# EasyEDA Pro project Hitboard_PCB_v1.0.epro

# Board PCB1
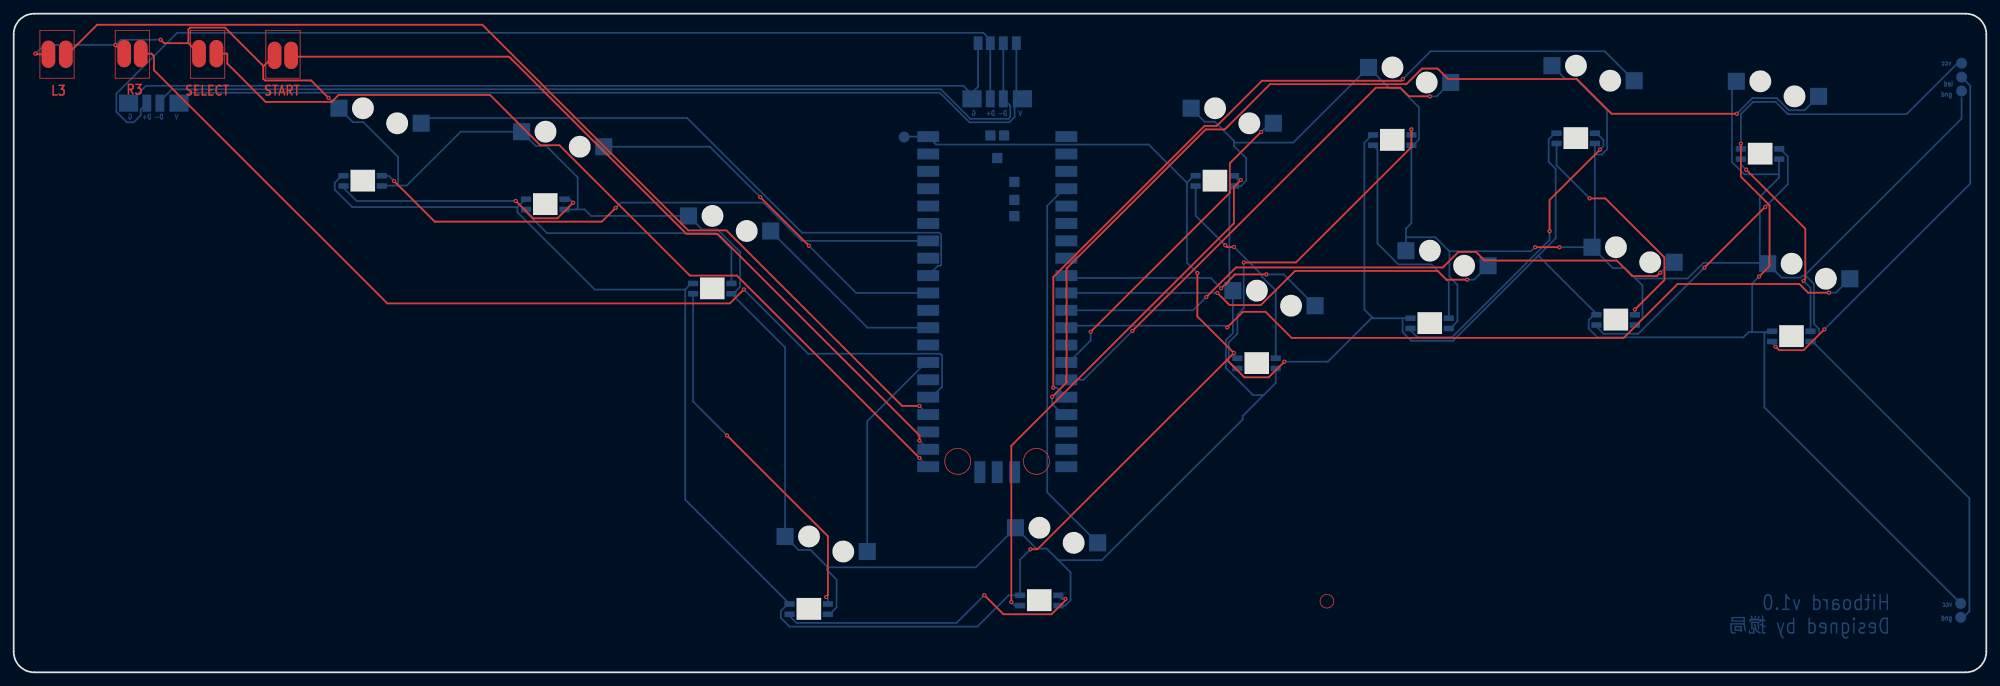
[diagram p0: board, top side]
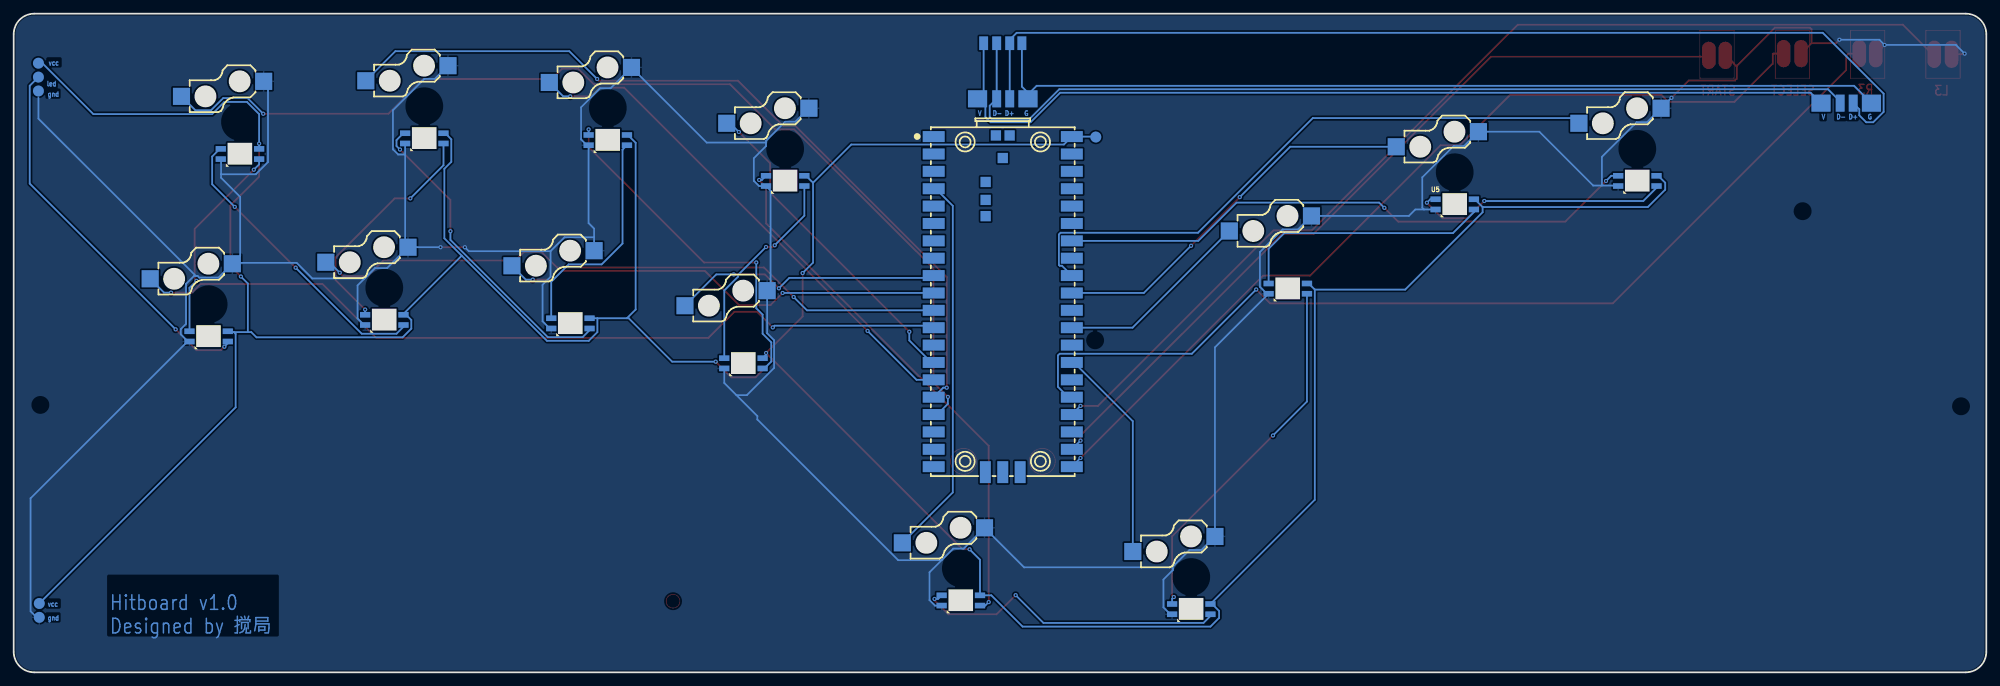
[diagram p1: board, bottom side, seen from below]

Outline 288.1 x 96.3 mm; copper layers: Top Layer, Bottom Layer. Coordinates in mm from the lower left corner of the outline.
Outline path: 0,93.3 0,3 arc(0.88,0.88) 3,0 285.1,0 arc(287.22,0.88) 288.1,3 288.1,93.3 arc(287.22,95.42) 285.1,96.3 3,96.3 arc(0.88,95.42) 0,93.3
Stack: Top Layer 0.035mm / Dielectric1 1.51mm FR4 er 4.5 / Bottom Layer 0.035mm

## Design rules (mm)
template: JLCPCB Capability(Two Layers Board)
spacing copperThickness1oz (default): track to track 0.102, other pairs 0.152 to 0.3
spacing copperThickness2oz: track to track 0.203, other pairs 0.152 to 0.3
track width copperThickness1oz (default): min 0.127, default 0.254, max 2.54
track width copperThickness2oz: min 0.203, default 0.254, max 2.54
differential pair differentialPair (default): width min 0.127, default 0.254, max 2.54; gap min 0.152, default 0.152
via viaSize (default): diameter min 0.5, default 0.61, max 10; hole min 0.3, default 0.305, max 6.3

## Placement (name value [footprint] x y rotation side)
NOREF  -  [Pad_e688]  139.96 83.85 180 top
NOREF#2  -  [Pad_e677]  16.14 90.46 0 top
NOREF#3  -  [Pad_e678]  18.55 90.46 0 top
NOREF#4  -  [Pad_e691]  142.63 91.98 180 top
NOREF#5  -  [Pad_e686]  24.14 83.22 180 top
NOREF#6  -  [Pad_e692]  144.54 83.85 180 top
NOREF#7  -  [Pad_e690]  142.63 83.85 180 top
NOREF#8  -  [Pad_e681]  38.11 90.2 0 top
NOREF#9  -  [Pad_e676]  7.61 90.37 0 top
NOREF#10  -  [Pad_e682]  40.52 90.2 0 top
NOREF#11  -  [Pad_e680]  29.6 90.46 0 top
NOREF#12  -  [Pad_e693]  144.54 91.98 180 top
NOREF#13  -  [Pad_e695]  147.33 83.85 180 top
NOREF#14  -  [Pad_e698]  284.49 85 0 top
NOREF#15  -  [Pad_e685]  21.35 83.22 180 top
NOREF#16  -  [Pad_e687]  130.06 78.27 0 top
NOREF#17  -  [Pad_e683]  16.77 83.22 180 top
NOREF#18  -  [Pad_e684]  19.44 83.22 180 top
NOREF#19  -  [Pad_e700]  284.49 89.06 0 top
NOREF#20  -  [Pad_e696]  284.36 8.03 0 top
NOREF#21  -  [Pad_e699]  284.49 87.03 0 top
NOREF#22  -  [Pad_e679]  27.06 90.46 0 top
NOREF#23  -  [Pad_e697]  284.36 10.07 0 top
NOREF#24  -  [Pad_e694]  146.44 91.98 180 top
NOREF#25  -  [Pad_e675]  5.07 90.37 0 top
NOREF#26  -  [Pad_e689]  140.85 91.98 180 top
U1  PICO  [COMM-SMD_L51.0-W21.0-P2.54_SC0916]  143.65 53.88 270 bottom
U5  -  [LED-SMD_L3.2-W2.8_YO-WS2812B-3528]  50.96 71.85 180 bottom
U5#2  -  [LED-SMD_L3.2-W2.8_YO-WS2812B-3528]  77.63 68.42 180 bottom
U5#3  -  [LED-SMD_L3.2-W2.8_YO-WS2812B-3528]  102.02 56.1 180 bottom
U5#4  -  [LED-SMD_L3.2-W2.8_YO-WS2812B-3528]  116.12 9.24 180 bottom
U5#5  -  [LED-SMD_L3.2-W2.8_YO-WS2812B-3528]  149.77 10.51 180 bottom
U5#6  -  [LED-SMD_L3.2-W2.8_YO-WS2812B-3528]  175.42 71.85 180 bottom
U5#7  -  [LED-SMD_L3.2-W2.8_YO-WS2812B-3528]  181.52 45.18 180 bottom
U5#8  -  [LED-SMD_L3.2-W2.8_YO-WS2812B-3528]  201.33 77.82 180 bottom
U5#9  -  [LED-SMD_L3.2-W2.8_YO-WS2812B-3528]  206.79 51.02 180 bottom
U5#10  -  [LED-SMD_L3.2-W2.8_YO-WS2812B-3528]  228.13 78.07 180 bottom
U5#11  -  [LED-SMD_L3.2-W2.8_YO-WS2812B-3528]  233.97 51.53 180 bottom
U5#12  -  [LED-SMD_L3.2-W2.8_YO-WS2812B-3528]  255.05 75.79 180 bottom
U5#13  -  [LED-SMD_L3.2-W2.8_YO-WS2812B-3528]  259.63 49.12 180 bottom
U6  -  [CONN-SMD_HOTPLUGPAKAGE__C9900010116-1]  53.5 81.37 180 bottom
U6#2  -  [CONN-SMD_HOTPLUGPAKAGE__C9900010116-1]  80.17 77.94 180 bottom
U6#3  -  [CONN-SMD_HOTPLUGPAKAGE__C9900010116-1]  104.56 65.63 180 bottom
U6#4  -  [CONN-SMD_HOTPLUGPAKAGE__C9900010116-1]  118.66 18.76 180 bottom
U6#5  -  [CONN-SMD_HOTPLUGPAKAGE__C9900010116-1]  152.31 20.03 180 bottom
U6#6  -  [CONN-SMD_HOTPLUGPAKAGE__C9900010116-1]  177.96 81.37 180 bottom
U6#7  -  [CONN-SMD_HOTPLUGPAKAGE__C9900010116-1]  184.06 54.7 180 bottom
U6#8  -  [CONN-SMD_HOTPLUGPAKAGE__C9900010116-1]  203.87 87.34 180 bottom
U6#9  -  [CONN-SMD_HOTPLUGPAKAGE__C9900010116-1]  209.33 60.55 180 bottom
U6#10  -  [CONN-SMD_HOTPLUGPAKAGE__C9900010116-1]  230.67 87.6 180 bottom
U6#11  -  [CONN-SMD_HOTPLUGPAKAGE__C9900010116-1]  236.51 61.05 180 bottom
U6#12  -  [CONN-SMD_HOTPLUGPAKAGE__C9900010116-1]  257.59 85.31 180 bottom
U6#13  -  [CONN-SMD_HOTPLUGPAKAGE__C9900010116-1]  262.17 58.64 180 bottom

## Footprints (pads in the part's own frame, mm; a bottom-side part is the same pattern mirrored in y, then rotated)
COMM-SMD_L51.0-W21.0-P2.54_SC0916
  rect 1.6x3.2 smd: 1(-24.445,-10.088) 2(-21.905,-10.088) 3(-19.365,-10.088) 4(-16.825,-10.088) 5(-14.285,-10.088) 6(-11.745,-10.088) 7(-9.205,-10.088) 8(-6.665,-10.088) 9(-4.125,-10.088) 10(-1.585,-10.088) 11(0.955,-10.088) 12(3.495,-10.088) 13(6.035,-10.088) 14(8.575,-10.088) 15(11.115,-10.088) 16(13.655,-10.088) 17(16.195,-10.088) 18(18.735,-10.088) 19(21.275,-10.088) 20(23.815,-10.088) 21(23.815,10.088) 22(21.275,10.088) 23(18.735,10.088) 24(16.195,10.088) 25(13.655,10.088) 26(11.115,10.088) 27(8.575,10.088) 28(6.035,10.088) 29(3.495,10.088) 30(0.955,10.088) 31(-1.585,10.088) 32(-4.125,10.088) 33(-6.665,10.088) 34(-9.205,10.088) 35(-11.745,10.088) 36(-14.285,10.088) 37(-16.825,10.088) 38(-19.365,10.088) 39(-21.905,10.088) 40(-24.445,10.088)
  rect 3.2x1.6 smd: 41(24.615,-2.54) 42(24.615,0) 43(24.615,2.54)
  rect 1.5x1.5 smd: TP1(-21.315,0) TP2(-24.615,1) TP3(-24.615,-1) TP4(-17.815,-2.5) TP5(-15.188,-2.5) TP6(-12.815,-2.5)
CONN-SMD_HOTPLUGPAKAGE__C9900010116-1
  rect 2.5x2.5 smd: 1(-6,-1.1) 2(6,1.1)
LED-SMD_L3.2-W2.8_YO-WS2812B-3528
  rect 1.5x0.82 smd: 1(2.8,0.75) 2(2.8,-0.75) 3(-2.8,-0.75) 4(-2.8,0.75)
Pad_e675
  oval 2x4 smd: 1(0,0)
Pad_e676
  oval 2x4 smd: 1(0,0)
Pad_e677
  oval 2x4 smd: 1(0,0)
Pad_e678
  oval 2x4 smd: 1(0,0)
Pad_e679
  oval 2x4 smd: 1(0,0)
Pad_e680
  oval 2x4 smd: 1(0,0)
Pad_e681
  oval 2x4 smd: 1(0,0)
Pad_e682
  oval 2x4 smd: 1(0,0)
Pad_e683
  rect 2.8x2.5 smd far side: PTH(0,0)
Pad_e684
  rect 1.3x2.5 smd far side: PTH(0,0)
Pad_e685
  rect 1.3x2.5 smd far side: PTH(0,0)
Pad_e686
  rect 2.8x2.5 smd far side: PTH(0,0)
Pad_e687
  round 1.6 smd far side: PTH(0,0)
Pad_e688
  rect 2.8x2.5 smd far side: PTH(0,0)
Pad_e689
  rect 1.3x2 smd far side: PTH(0,0)
Pad_e690
  rect 1.3x2.5 smd far side: PTH(0,0)
Pad_e691
  rect 1.3x2 smd far side: PTH(0,0)
Pad_e692
  rect 1.3x2.5 smd far side: PTH(0,0)
Pad_e693
  rect 1.3x2 smd far side: PTH(0,0)
Pad_e694
  rect 1.3x2 smd far side: PTH(0,0)
Pad_e695
  rect 2.8x2.5 smd far side: PTH(0,0)
Pad_e696
  round 1.6 smd far side: PTH(0,0)
Pad_e697
  round 1.6 smd far side: PTH(0,0)
Pad_e698
  round 1.6 smd far side: PTH(0,0)
Pad_e699
  round 1.6 smd far side: PTH(0,0)
Pad_e700
  round 1.6 smd far side: PTH(0,0)

## Nets
GND: NOREF#2.1 NOREF#8.1 NOREF#14.PTH NOREF#20.PTH NOREF#22.1 NOREF#25.1 U5.3 U5#2.3 U5#3.3 U5#4.3 U5#5.3 U5#6.3 U5#7.3 U5#8.3 U5#9.3 U5#10.3 U5#11.3 U5#12.3 U5#13.3 U6.2 U6#2.2 U6#3.2 U6#4.2 U6#5.2 U6#6.2 U6#7.2 U6#8.2 U6#9.2 U6#10.2 U6#11.2 U6#12.2 U6#13.2
VCC: NOREF#16.PTH NOREF#19.PTH NOREF#23.PTH U1.40 U5.1 U5#2.1 U5#3.1 U5#4.1 U5#5.1 U5#6.1 U5#7.1 U5#8.1 U5#9.1 U5#10.1 U5#11.1 U5#12.1 U5#13.1
2: U5.2 U5#2.4
3: U5#2.2 U5#3.4
4: U5#3.2 U5#4.4
5: U5#4.2 U5#5.4
6: U5#5.2 U5#6.4
7: U5#6.2 U5#7.4
8: U5#7.2 U5#8.4
9: U5#8.2 U5#9.4
10: U5#9.2 U5#10.4
11: U5#10.2 U5#11.4
12: U5#11.2 U5#12.4
13: U5#12.2 U5#13.4
14: NOREF#21.PTH U5#13.2
A: U1.9 U6#7.1
B: U1.10 U6#9.1
CAPTURE: U1.27 U6#4.1
D+: NOREF#4.PTH NOREF#7.PTH NOREF#18.PTH
D-: NOREF#6.PTH NOREF#12.PTH NOREF#15.PTH
DOWN: U1.31 U6#2.1
G: NOREF.PTH NOREF#17.PTH NOREF#26.PTH
HOME: U1.26
L3: NOREF#9.1 U1.24
LB: U1.17 U6#12.1
LED1: U1.34 U5.4
LEFT: U1.32 U6.1
LT: U1.12 U6#13.1
R3: NOREF#3.1 U1.25
RB: U1.16 U6#10.1
RIGHT: U1.29 U6#3.1
RT: U1.11 U6#11.1
SELECT: NOREF#11.1 U1.21
START: NOREF#10.1 U1.22
UP: U1.4 U6#5.1
V: NOREF#5.PTH NOREF#13.PTH NOREF#24.PTH
X: U1.14 U6#6.1
Y: U1.15 U6#8.1

Pads without a net: U1 1 2 3 5 6 7 8 13 18 19 20 23 28 30 33 35 36 37 38 39 41 42 43 TP1 TP2 TP3 TP4 TP5 TP6

## Via types
v1: diameter 0.61, hole 0.305, Top Layer to Bottom Layer, 58 vias

## Routing (per net, layer and track width the routed paths; a pad name or vN(x,y) marks a point on that pad's centre or on a via; arc(x,y) is an arc through that point)
GND: length 657.3
  Top Layer w0.254: 36.44,88.57 36.44,86.79 36.7,86.54 43.44,86.54 v1(45.98,84) ; 36.44,88.57 36.44,88.68 30.85,94.27 25.77,94.27 25.52,94.01 25.52,91.98 ; 36.44,88.57 37.97,90.09 NOREF#8.1 ; 25.52,91.98 21.96,91.98 v1(21.46,92.49) ; 25.52,91.98 26.79,90.71 NOREF#22.1 ; NOREF#25.1 3.51,90.37 3.42,90.46 v1(3.17,90.46) ; v1(14.85,91.73) 15.87,90.71 NOREF#2.1 ; v1(222.2,62.15) v1(225.76,62.15)
  Bottom Layer w0.254: U5#4.3 119.17,8.49 120.19,9.5 120.19,13.57 118.79,14.97 118.79,15.22 118.92,15.35 ; 203.33,63.61 207.65,63.61 209.68,61.57 ; 203.33,63.61 203.33,64.88 204.13,65.67 U5#8.3 204.39,77.07 205.24,77.92 205.24,82.6 202.44,85.39 200.92,85.39 U6#8.2 186.88,77.45 178.22,77.45 ; 203.33,63.61 U6#9.2 ; 230.93,75.71 231.95,75.71 232.71,76.47 232.71,82.18 228.14,86.75 226.61,86.75 U6#10.2 ; 230.93,75.71 U5#10.3 ; 230.93,75.71 230.93,62.57 U6#11.2 ; 152.57,16.4 154.35,14.62 154.35,10.56 153.55,9.76 U5#5.3 ; 152.57,16.4 158.92,16.4 179.49,36.97 179.49,37.48 182.54,40.53 ; 152.57,16.4 150.88,18.09 149.36,18.09 U6#5.2 140.52,15.35 118.92,15.35 ; 261.5,57.96 284.49,80.95 284.49,83.98 ; 261.5,57.96 261.75,57.96 262.93,56.78 262.93,50.94 263.7,50.18 263.7,49.42 262.68,48.4 ; 261.5,57.96 261.25,57.96 260.99,57.71 258.2,57.71 256.04,59.87 ; U6#6.2 173.94,80.5 175.43,80.5 178.22,77.7 178.22,77.45 ; 209.68,61.57 221.62,61.57 v1(222.2,62.15) ; 209.68,61.57 209.68,57.84 210.86,56.66 210.86,51.32 209.97,50.43 209.75,50.43 U5#9.3 ; U5#12.3 257.82,75 257.82,72.82 ; 257.82,72.82 252.74,72.82 250.96,74.6 250.96,85.78 251.59,86.41 ; 257.82,72.82 257.82,72.31 255.02,69.52 255.02,60.88 256.04,59.87 ; 118.92,15.35 116.38,17.89 114.63,17.89 U6#4.2 112.66,47.51 U5#3.3 105.07,55.35 106.09,56.37 106.09,61.45 102.79,64.75 100.54,64.75 U6#3.2 84.33,66.73 83.39,67.67 82.12,67.67 ; 182.54,40.53 184.32,42.3 U5#7.3 ; 182.54,40.53 181.02,40.53 177.04,44.5 177.04,48.56 178.06,49.58 U6#7.2 177.55,56.31 177.55,70.43 U5#6.3 179.24,71.1 180,71.86 180,75.16 178.22,76.94 178.22,77.45 ; 82.12,67.67 U5#2.3 ; 82.12,67.67 82.38,67.92 82.38,72.37 77.8,76.94 76.28,76.94 U6#2.2 65.28,79.04 57.41,71.17 56.14,71.17 ; v1(3.17,90.46) 4.44,91.73 v1(14.85,91.73) 15.61,92.49 v1(21.46,92.49) ; 262.68,48.4 U5#13.3 ; 262.68,48.4 285.63,25.45 285.63,8.92 284.36,7.65 ; v1(225.76,62.15) U6#11.2 ; U6#11.2 233.56,59.11 235.34,59.11 236.86,57.58 ; 256.04,59.87 246.77,59.87 244.48,57.58 236.86,57.58 ; 236.86,57.58 237.88,56.57 237.88,51.74 236.92,50.78 U5#11.3 ; 56.14,71.17 53.84,71.17 U5.3 ; 56.14,71.17 56.14,75.36 51.06,80.44 49.54,80.44 U6.2 v1(45.98,84)
VCC: length 552.8
  Top Layer w0.254: v1(148.49,17.99) 149.51,17.99 177.2,45.67 ; 177.2,45.67 v1(178.21,46.69) 172.88,52.02 v1(172.88,58.38) ; 177.2,45.67 179.74,43.13 183.29,43.13 v1(185.58,45.42) ; v1(254.92,57.87) 256.44,59.39 256.44,68.28 252.25,72.47 v1(252.25,77.3)
  Bottom Layer w0.254: 255.94,49.74 256.7,49.74 U5#13.1 ; 255.94,49.74 253.9,49.74 ; 255.94,49.74 255.68,49.48 255.68,38.75 NOREF#23.PTH ; 198.53,51.77 202.85,51.77 ; 198.53,51.77 197.26,53.04 197.26,77.42 198.41,78.57 U5#8.1 ; 198.53,51.77 198.28,51.77 191.93,45.42 v1(185.58,45.42) ; 202.85,51.77 202.85,49.74 204.12,48.47 210.22,48.47 222.66,60.91 ; 202.85,51.77 U5#9.1 ; v1(178.21,46.69) 178.21,46.44 U5#7.1 ; 253.9,49.74 253.4,49.74 252.63,48.98 231.3,48.98 230.03,50.25 230.03,51.52 231.04,52.53 ; 253.9,49.74 253.9,56.85 v1(254.92,57.87) ; NOREF#19.PTH 283.91,89.06 276.46,81.62 259.11,81.62 257.33,83.39 254.03,83.39 252.25,81.62 v1(252.25,77.3) U5#12.1 ; NOREF#16.PTH 130.12,78.33 U1.40 134.72,77.17 165.77,77.17 171.35,71.58 ; U5#2.1 74.71,69.17 73.56,68.03 ; 171.35,71.58 171.35,59.9 v1(172.88,58.38) ; 171.35,71.58 172.37,72.6 U5#6.1 ; 222.66,60.91 225.2,63.45 225.2,73.61 224.19,74.63 224.19,77.93 225.08,78.82 U5#10.1 ; 222.66,60.91 231.04,52.53 ; 73.56,68.03 49.43,68.03 46.89,70.57 46.89,71.58 47.91,72.6 U5.1 ; 73.56,68.03 73.56,67.27 84.87,55.96 98.08,55.96 ; 98.08,55.96 98.96,56.85 U5#3.1 ; 98.08,55.96 98.08,25.23 U5#4.1 113.06,9.99 112.05,8.97 112.05,7.96 113.32,6.69 140.75,6.69 145.32,11.26 U5#5.1 146.97,16.47 v1(148.49,17.99) ; 231.04,52.53 231.04,52.41 U5#11.1
2: length 38.1
  Top Layer w0.254: v1(73.32,68.92) 75.86,66.38 79.42,66.38 v1(81.7,68.66)
  Bottom Layer w0.254: v1(81.7,68.66) 81.2,69.17 U5#2.4 ; v1(73.32,68.92) 50.09,68.92 48.16,70.84 U5.2
3: length 37.7
  Bottom Layer w0.254: U5#2.2 74.83,67.28 77.89,64.22 102.53,64.22 104.82,61.93 U5#3.4
4: length 53.7
  Top Layer w0.254: v1(104.18,34.63) 118.92,19.89 118.92,11.26 v1(118.66,11)
  Bottom Layer w0.254: v1(104.18,34.63) 99.22,39.59 U5#3.2 ; U5#4.4 118.92,10.75 v1(118.66,11)
5: length 46.1
  Top Layer w0.254: v1(141.76,11.28) 144.56,8.49 151.58,8.49 153.61,10.52 v1(153.61,10.73)
  Bottom Layer w0.254: U5#4.2 113.32,8.23 114.33,7.22 137.7,7.22 v1(141.76,11.28) ; v1(153.61,10.73) 153.1,10.73 U5#5.4
6: length 78.3
  Top Layer w0.254: v1(179.23,71.99) 178.21,70.97 178.21,65.64 145.7,33.13 v1(145.7,10.27)
  Bottom Layer w0.254: U5#6.4 178.84,71.99 v1(179.23,71.99) ; v1(145.7,10.27) 146.21,9.76 U5#5.2
7: length 30.6
  Top Layer w0.254: v1(176.95,62.44) 177.21,62.18 v1(178.22,62.18)
  Bottom Layer w0.254: v1(178.22,62.18) 182.29,58.12 182.29,57.87 184.32,55.83 U5#7.4 ; v1(176.95,62.44) 172.62,66.77 U5#6.2
8: length 51.9
  Top Layer w0.254: v1(204.13,79.38) 204.13,76.79 187.27,59.92 v1(179.65,59.92)
  Bottom Layer w0.254: U5#7.2 178.47,44.43 177.45,45.44 177.45,48.24 178.72,49.51 178.72,52.3 179.65,53.23 v1(179.65,59.92) ; v1(204.13,79.38) U5#8.4
9: length 32.7
  Bottom Layer w0.254: U5#8.2 199.18,76.42 199.18,62.69 202.23,59.64 207.05,59.64 209.59,57.1 U5#9.4
10: length 46.4
  Top Layer w0.254: v1(224.31,64.49) 224.31,69.07 v1(231.68,76.43)
  Bottom Layer w0.254: v1(224.31,64.49) 224.31,63.22 210.09,49 205.01,49 203.99,50.02 U5#9.2 ; v1(231.68,76.43) 232.19,76.94 232.19,77.82 231.18,78.82 U5#10.4
11: length 34.7
  Top Layer w0.254: v1(236.77,53.04) 241.09,57.36 241.09,60.66 232.45,69.3 v1(230.17,69.3)
  Bottom Layer w0.254: v1(230.17,69.3) 225.33,74.13 U5#10.2 ; U5#11.4 v1(236.77,53.04)
12: length 43.4
  Top Layer w0.254: v1(246.92,59.16) v1(255.81,68.05)
  Bottom Layer w0.254: U5#11.2 231.17,50.52 232.19,49.51 237.27,49.51 v1(246.92,59.16) ; v1(255.81,68.05) 259.11,71.35 259.11,75.42 257.99,76.54 U5#12.4
13: length 29.6
  Top Layer w0.254: v1(253.03,73.49) 261.66,64.85 261.66,57.49 v1(261.41,57.23)
  Bottom Layer w0.254: v1(253.03,73.49) 252.25,74.26 U5#12.2 ; U5#13.4 262.43,56.22 v1(261.41,57.23)
14: length 55.6
  Top Layer w0.254: v1(264.45,50.14) 261.4,47.1 257.84,47.1 v1(257.33,47.6)
  Bottom Layer w0.254: U5#13.2 256.83,48.11 v1(257.33,47.6) ; 284.49,86.52 285,86.52 285.76,85.76 285.76,71.46 v1(264.45,50.14)
A: length 39.8
  Top Layer w0.254: v1(176.34,56.14) 178.38,58.18 v1(182.95,58.18)
  Bottom Layer w0.254: U1.9 154.07,57.67 174.82,57.67 v1(176.34,56.14) ; v1(182.95,58.18) 185.49,58.18 U6#7.1
B: length 65.8
  Top Layer w0.254: v1(175.79,55.47) 177.57,53.69 182.14,53.69 187.14,58.68 207.97,58.68 209.24,57.41 v1(212.29,57.41)
  Bottom Layer w0.254: v1(175.79,55.47) U1.10 ; v1(212.29,57.41) 213.3,57.41 U6#9.1
CAPTURE: length 31.5
  Bottom Layer w0.254: 124.66,17.66 124.66,36.71 133.25,45.31 U1.27
D+: length 149.8
  Bottom Layer w0.254: NOREF#18.PTH 18.55,82.33 18.55,81.44 17.54,80.42 16.52,80.42 15,81.95 15,84.62 23.89,93.51 141.61,93.51 142.63,92.49 NOREF#4.PTH NOREF#7.PTH
D-: length 138.3
  Bottom Layer w0.254: NOREF#15.PTH 21.35,83.47 23.12,85.25 135.39,85.25 139.71,80.93 145.3,80.93 145.55,81.19 145.55,82.84 NOREF#6.PTH NOREF#12.PTH
DOWN: length 56.2
  Top Layer w0.254: v1(109.03,69.48) v1(116.15,62.37)
  Bottom Layer w0.254: U1.31 123.05,55.47 v1(116.15,62.37) ; U6#2.1 101.67,76.84 v1(109.03,69.48)
G: length 133.3
  Bottom Layer w0.254: 139.96,84.49 138.69,85.76 19.31,85.76 NOREF#17.PTH ; 139.96,84.49 NOREF.PTH ; 139.96,84.49 139.96,84.74 140.85,85.63 NOREF#26.PTH
L3: length 151.3
  Top Layer w0.254: NOREF#9.1 7.87,90.37 12.18,94.68 68.43,94.68 98.51,64.61 104.1,64.61 129.75,38.96 v1(132.29,38.96)
  Bottom Layer w0.254: U1.24 v1(132.29,38.96)
LB: length 150.6
  Top Layer w0.254: v1(151.66,40.27) 153.78,42.38 153.78,59.06 174.1,79.38 176.89,79.38 183.49,85.99 203.4,85.99 205.68,88.27 207.97,88.27 209.49,86.75 228.29,86.75 233.37,81.67 v1(251.66,81.67)
  Bottom Layer w0.254: U1.17 153.69,37.73 153.18,37.73 151.66,39.25 v1(151.66,40.27) ; v1(251.66,81.67) 253.94,83.96 257.5,83.96 259.28,82.18 261.56,82.18 U6#12.1
LED1: length 86
  Top Layer w0.254: v1(87.91,67.91) 85.9,65.89 61.48,65.89 v1(55.54,71.84)
  Bottom Layer w0.254: U5.4 54.78,72.6 v1(55.54,71.84) ; U1.34 115.09,63.09 109.5,68.67 88.68,68.67 v1(87.91,67.91)
LEFT: length 90.3
  Bottom Layer w0.254: U6.1 60.27,81.04 98.37,81.04 115.13,64.27 135.2,64.27 135.45,64.02 135.45,59.56 135.33,59.45 135,59.45 U1.32
LT: length 121.8
  Top Layer w0.254: v1(177.23,50.43) 179.52,52.71 182.82,52.71 186.63,48.91 235.15,48.91 243.02,56.78 260.8,56.78 262.07,55.51 v1(265.12,55.51)
  Bottom Layer w0.254: v1(177.23,50.43) 176.98,50.68 154.03,50.68 U1.12 ; U6#13.1 266.13,55.51 v1(265.12,55.51)
R3: length 145.4
  Top Layer w0.254: v1(106.64,55.97) 104.6,53.94 54.57,53.94 20.48,88.03 20.48,90.1 20.11,90.46 NOREF#3.1
  Bottom Layer w0.254: v1(106.64,55.97) 116.03,46.58 135.34,46.58 135.59,46.32 135.59,41.75 134.07,40.23 U1.25
RB: length 119
  Top Layer w0.254: v1(202.89,86.75) 202.63,86.5 182.31,86.5 175.71,79.89 173.93,79.89 151.83,57.79 v1(151.83,41.62)
  Bottom Layer w0.254: U1.16 152.34,41.62 v1(151.83,41.62) ; v1(202.89,86.75) 206.95,90.81 232.35,90.81 U6#10.1
RIGHT: length 28.9
  Bottom Layer w0.254: U6#3.1 124.7,50.39 U1.29
RT: length 94.6
  Top Layer w0.254: v1(174.19,54.87) 178.5,59.19 208.73,59.19 211.02,61.48 213.56,61.48 214.83,60.21 234.13,60.21 236.42,57.92 239.97,57.92 v1(240.48,58.43)
  Bottom Layer w0.254: U1.11 172.24,52.93 v1(174.19,54.87) ; v1(240.48,58.43) 242,59.95 U6#11.1
SELECT: length 130.6
  Top Layer w0.254: v1(132.29,31.34) 105.62,58.01 98.76,58.01 79.71,77.06 76.92,77.06 69.55,84.42 47.45,84.42 46.44,83.41 36.79,83.41 31.2,89 31.2,90.4 31.14,90.46 NOREF#11.1
  Bottom Layer w0.254: U1.21 v1(132.29,31.34)
START: length 117.4
  Top Layer w0.254: NOREF#10.1 40.6,90.26 40.85,90.01 72.35,90.01 98.25,64.1 102.83,64.1 132.29,34.64 v1(132.29,33.88)
  Bottom Layer w0.254: U1.22 v1(132.29,33.88)
UP: length 56.2
  Bottom Layer w0.254: U6#5.1 150.94,26.3 150.94,68.21 153.44,70.71 U1.4
V: length 136.4
  Bottom Layer w0.254: NOREF#24.PTH 146.44,84.74 NOREF#13.PTH 146.19,82.71 146.19,81.19 145.42,80.42 139.58,80.42 135.26,84.74 25.66,84.74 NOREF#5.PTH
X: length 48
  Top Layer w0.254: v1(157.29,49.79) 177.61,70.11 177.61,74.43 v1(182.19,79)
  Bottom Layer w0.254: v1(182.19,79) 183.46,80.27 U6#6.1 ; U1.14 154.08,45.31 157.29,48.52 v1(157.29,49.79)
Y: length 75.2
  Top Layer w0.254: v1(206.82,84.21) 203.78,84.21 202.51,85.48 198.95,85.48 v1(163.39,49.92)
  Bottom Layer w0.254: v1(163.39,49.92) 156.24,42.77 U1.15 ; v1(206.82,84.21) 207.84,84.21 U6#8.1

## Copper pours and planes (outline as drawn; the poured copper is in the pictures)
GND on Bottom Layer: -5.71,102.9 291.22,102.9 291.22,-3.52 -5.71,-3.52

## Text on the board
Bottom Layer: G | D+ | D- | V | vcc | gnd | led | Hitboard v1.0 / Designed by 搅局
Top Layer: L3 | R3 | SELECT | START
